# Altium schematic sheet REGENIX_DRIVER_3.SchDoc
size A4; SheetNumber: 13; SheetTotal: 17
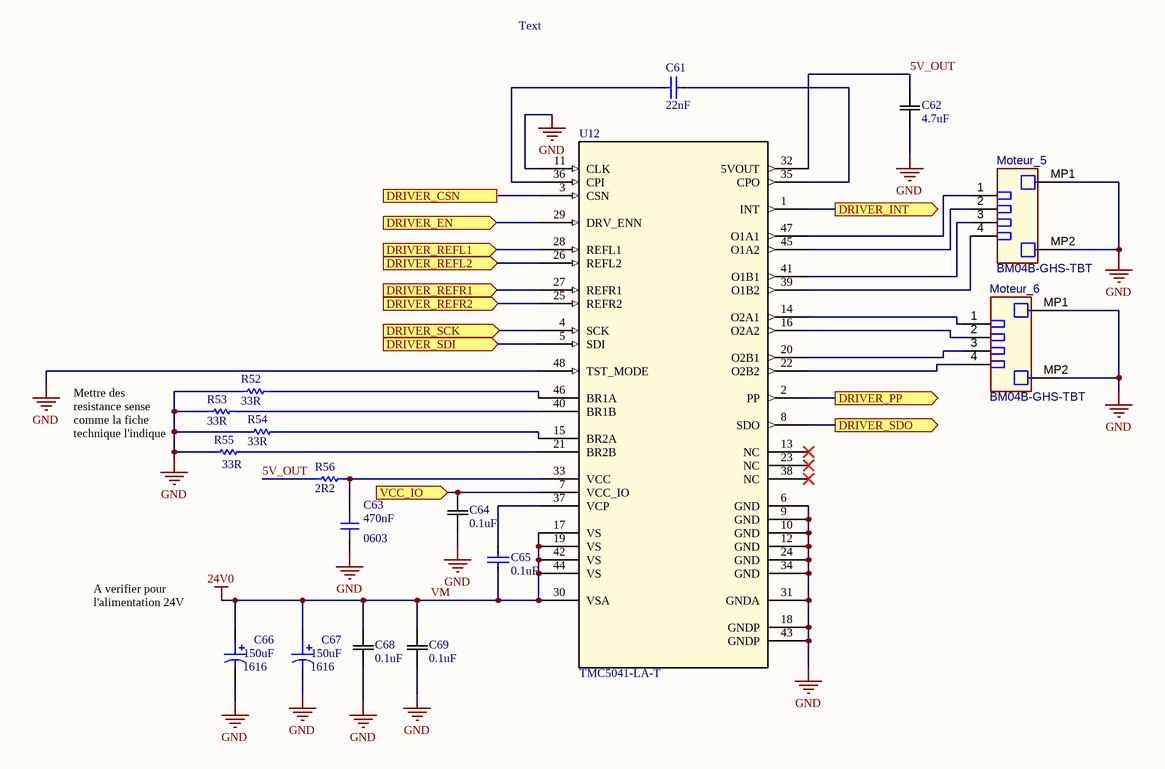
[diagram p0: REGENIX_DRIVER_3.SchDoc]

## Parts
C61  value 22nF  [CAPACITOR-0603]  (hidden comment: Capacitor-0603-0.22uF-25V-X7R)
C62  4.7uF  [CAP_CL21_SAM]
C63  value 470nF  Package: 0603  [CAP_0603]  (hidden comment: CAP - 0603)
C64  0.1uF  [CAP_CL10_SAM]
C65  value 0.1uF  [CAPACITOR-0603]  (hidden comment: Capacitor-0603-0.22uF-25V-X7R)
C66  value 150uF  Package: 1616  [CAP_ALU_1616_vishay]  (hidden comment: MAL214699108E3)
C67  value 150uF  Package: 1616  [CAP_ALU_1616_vishay]  (hidden comment: MAL214699108E3)
C68  0.1uF  [CAP_CL10_SAM]
C69  0.1uF  [CAP_CL10_SAM]
Moteur_5  BM04B-GHS-TBT  [JST-BM04B-GHS-TBT_V]
Moteur_6  BM04B-GHS-TBT  [JST-BM04B-GHS-TBT_V]
R52  value 33R  [RESISTOR-1206]  (hidden comment: SMT resistor)
R53  value 33R  [RESISTOR-1206]  (hidden comment: SMT resistor)
R54  value 33R  [RESISTOR-1206]  (hidden comment: SMT resistor)
R55  value 33R  [RESISTOR-1206]  (hidden comment: SMT resistor)
R56  value 2R2  [Resistor-0603]  (hidden comment: SMT resistor)
U12  TMC5041-LA-T  [QFN48_7X7_TRI]

## Ports
DRIVER_CSN (in), DRIVER_EN (in), DRIVER_INT (out), DRIVER_PP (out), DRIVER_REFL1 (in), DRIVER_REFL2 (in), DRIVER_REFR1 (in), DRIVER_REFR2 (in), DRIVER_SCK (in), DRIVER_SDI (in), DRIVER_SDO (out), VCC_IO (in)

## Nets
GND: C62.1 C63.1 C64.1 C66.2 C67.2 C68.1 C69.1 Moteur_5.MP1 Moteur_5.MP2 Moteur_6.MP1 Moteur_6.MP2 R52.1 R53.1 R54.1 R55.1 U12.6(GND) U12.9(GND) U12.10(GND) U12.11(CLK) U12.12(GND) U12.18(GNDP) U12.24(GND) U12.31(GNDA) U12.34(GND) U12.43(GNDP) U12.48(TST_MODE)
VM: C65.1 C66.1 C67.1 C68.2 C69.2 U12.17(VS) U12.19(VS) U12.30(VSA) U12.42(VS) U12.44(VS)  [also labelled 24V0]
5V_OUT: C62.2 R56.1 U12.32(5VOUT)
DRIVER_EN: U12.29(DRV_ENN) ; port DRIVER_EN
DRIVER_INT: U12.1(INT) ; port DRIVER_INT
DRIVER_PP: U12.2(PP) ; port DRIVER_PP
DRIVER_REFL1: U12.28(REFL1) ; port DRIVER_REFL1
DRIVER_REFL2: U12.26(REFL2) ; port DRIVER_REFL2
DRIVER_REFR1: U12.27(REFR1) ; port DRIVER_REFR1
DRIVER_REFR2: U12.25(REFR2) ; port DRIVER_REFR2
DRIVER_SCK: U12.4(SCK) ; port DRIVER_SCK
DRIVER_SDI: U12.5(SDI) ; port DRIVER_SDI
DRIVER_SDO: U12.8(SDO) ; port DRIVER_SDO
VCC_IO: C64.2 U12.7(VCC_IO) ; port VCC_IO
NetC61_1: C61.1 U12.36(CPI)
NetC61_2: C61.2 U12.35(CPO)
NetC63_2: C63.2 R56.2 U12.33(VCC)
NetC65_2: C65.2 U12.37(VCP)
NetMoteur_5_1: Moteur_5.1 U12.47(O1A1)
NetMoteur_5_2: Moteur_5.2 U12.45(O1A2)
NetMoteur_5_3: Moteur_5.3 U12.41(O1B1)
NetMoteur_5_4: Moteur_5.4 U12.39(O1B2)
NetMoteur_6_1: Moteur_6.1 U12.14(O2A1)
NetMoteur_6_2: Moteur_6.2 U12.16(O2A2)
NetMoteur_6_3: Moteur_6.3 U12.20(O2B1)
NetMoteur_6_4: Moteur_6.4 U12.22(O2B2)
NetR52_2: R52.2 U12.46(BR1A)
NetR53_2: R53.2 U12.40(BR1B)
NetR54_2: R54.2 U12.15(BR2A)
NetR55_2: R55.2 U12.21(BR2B)

Not connected (* = marked no-connect by the designer): U12 3(CSN) 13(NC)* 23(NC)* 38(NC)*

## Notes on the sheet
- Text
- Mettre des resistance sense comme la fiche technique l'indique
- (near C66) A verifier pour l'alimentation 24V

## Library data of the parts
C61 C65 = Capacitor-0603-0.22uF-25V-X7R: Precision: X7R-10%; Volt: 25V; Package / Case: Metric 1608, EIA 0603; Mounted: Yes; Supplier 1: Digi-Key; Supplier Part Number 1: 490-4935-2-ND; Supplier 2: Digi-Key; Supplier 3: Digi-Key; Supplier 4: Digi-Key
C62 = CL21A475KAQNNNE: CAP CER 4.7UF 25V X5R 0805  CL21A475KAQNNNE; Mfr_Name: Samsung
C63 = CAP - 0603: Precision: 10%; Current: *; CreatedBy: Jonathan Bouchard; Power: *
C64 C68 C69 = CL10B104KB8NNWC: CAP CER 0.1UF 50V X7R 0603 CL10B104KB8NNWC; Mfr_Name: Samsung
C66 C67 = CAP_ALU_MAL214699108E3: CAP - ALU 470uF 20% 50V - 1616; Current: 1.3A; Mfg: Vishay Dale; Mfg Part Number: MAL214699108E3; HelpURL: http://www.vishay.com/docs/28403/146cti.pdf; CreatedBy: Jonathan Bouchard; Temperature: -55°C to 125°C; Power: *; Supplier 1: Digikey; Supplier Part Number 1: 4442PHCT-ND
Moteur_5 Moteur_6 = CMP-002-00053-3: Header, Pitch 1.25 mm, 1 x 4 Position, Height 4.05 mm, -25 to 85 degC; Pins: 6
R52-R55 = Resistor1206-33R: Precision: 1%; Watt: 0.1W; Mounted: Yes; Package / Case: Metric 3216, EIA 1206; Supplier 2: Digi-Key; Supplier 4: Digi-Key; Supplier 1: Digi-Key; Supplier 3: Digi-Key; Supplier Part Number 1: 311-33.0FRTR-ND
R56 = Resistor0603-22R: Precision: 1%; Watt: 0.1W; Mounted: Yes; Package / Case: Metric 1608, EIA 0603; Supplier 2: Digi-Key; Supplier 4: Digi-Key; Supplier 1: Digi-Key; Supplier 3: Digi-Key; Supplier Part Number 1: RMCF0603FT22R0CT-ND
U12 = TMC5041-LA-T: No Description Available; Mfr_Name: Analog Devices / Trinamic; RefDes: RefDes; Type: Type